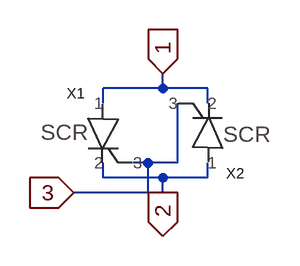
[diagram p0: schematic d30706ax.asc]
d30706ax.asc, the LTspice schematic file:
Version 4
SHEET 1 880 680
WIRE 80 176 80 160
WIRE 80 176 16 176
WIRE 128 176 80 176
WIRE 16 192 16 176
WIRE 128 192 128 176
WIRE 64 256 48 256
WIRE 96 256 96 192
WIRE 96 256 64 256
WIRE 16 272 16 256
WIRE 80 272 16 272
WIRE 128 272 128 256
WIRE 128 272 80 272
WIRE 64 288 64 256
WIRE 64 288 -16 288
WIRE 80 288 80 272
FLAG 80 160 1
IOPIN 80 160 In
FLAG -16 288 3
IOPIN -16 288 In
FLAG 80 288 2
IOPIN 80 288 Out
SYMBOL d30705bx 48 208 M0
SYMATTR InstName X1
SYMBOL d30705bx 96 240 M180
SYMATTR InstName X2

The netlist it stands for:
* d30706ax.asc
XX1 1 2 3 d30705bx  ; pins 1 2 3
XX2 2 1 3 d30705bx  ; pins 1 2 3
.backanno
.end